# Altium schematic sheet Adapter_board .SchDoc: Adapter_board
size A4; SheetNumber: 1; SheetTotal: 1
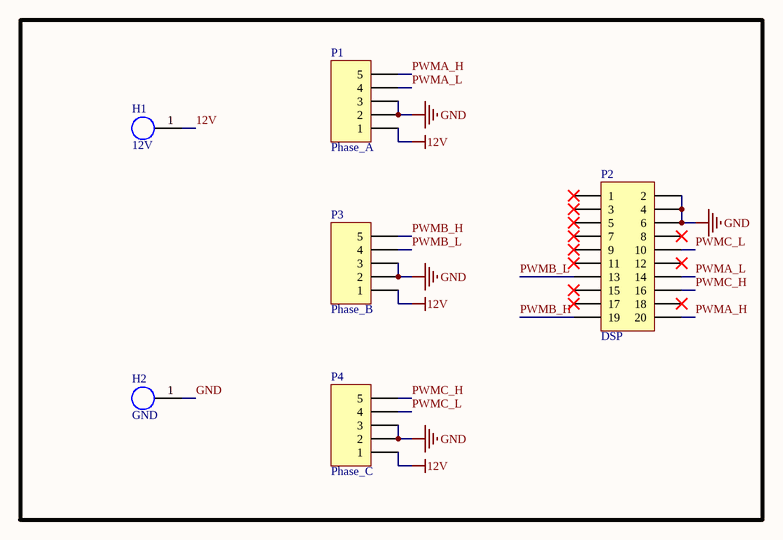
[diagram p0: Adapter_board .SchDoc]

## Parts
H1  12V  [HOLE]
H2  GND  [HOLE]
P1  Phase_A  [HDR1X5]
P2  DSP  [HDR2X10]
P3  Phase_B  [HDR1X5]
P4  Phase_C  [HDR1X5]

## Nets
12V: H1.1 P1.1 P3.1 P4.1
GND: H2.1 P1.2 P1.3 P2.2 P2.4 P2.6 P3.2 P3.3 P4.2 P4.3
PWMA_H: P1.5 P2.20
PWMA_L: P1.4 P2.14
PWMB_H: P2.19 P3.5
PWMB_L: P2.13 P3.4
PWMC_H: P2.16 P4.5
PWMC_L: P2.10 P4.4

Not connected (* = marked no-connect by the designer): P2 1* 3* 5* 7* 8* 9* 11* 12* 15* 17* 18*

## Library data of the parts
H1 H2 = HOLE
P1 P3 P4 = Header 5: Header, 5-Pin; LatestRevisionDate: 17-Jul-2002; LatestRevisionNote: Re-released for DXP Platform.; Publisher: Altium Limited
P2 = Header 10X2: Header, 10-Pin, Dual row; LatestRevisionDate: 17-Jul-2002; LatestRevisionNote: Re-released for DXP Platform.; Publisher: Altium Limited